# Altium project Atmega 2560.PrjPcb
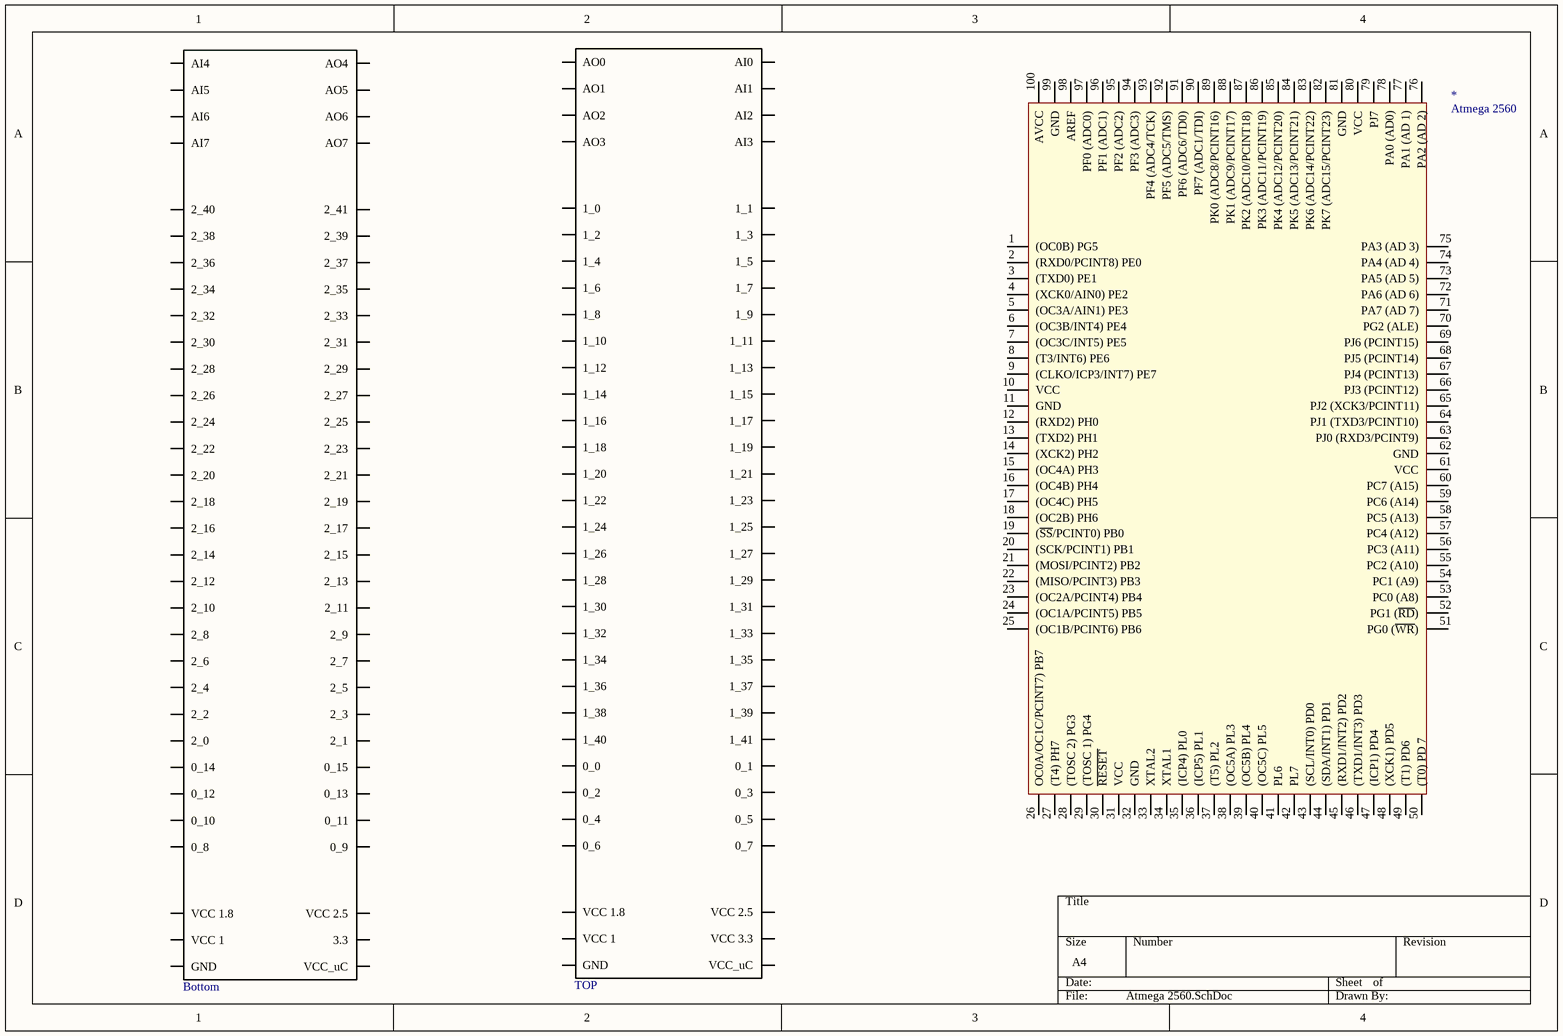
[diagram p0: Atmega 2560.SchDoc]
1 sheet, 3 parts. Net scope: global (net labels, ports and power ports of the same name join across sheets).
Board file: Atmega2560.PcbDoc

## Sheet Atmega 2560.SchDoc
size A4

### Parts
*  Atmega 2560
Bottom  CONNECTOR_BOTTOM  [Connector]  (value not drawn)
TOP  CONNECTOR_TOP  [Connector]  (value not drawn)

### Nets

Not connected (* = marked no-connect by the designer): * 1((OC0B)_PG5) 2((RXD0/PCINT8)_PE0) 3((TXD0)_PE1) 4((XCK0/AIN0)_PE2) 5((OC3A/AIN1)_PE3) 6((OC3B/INT4)_PE4) 7((OC3C/INT5)_PE5) 8((T3/INT6)_PE6) 9((CLKO/ICP3/INT7)_PE7) 10(VCC) 11(GND) 12((RXD2)_PH0) 13((TXD2)_PH1) 14((XCK2)_PH2) 15((OC4A)_PH3) 16((OC4B)_PH4) 17((OC4C)_PH5) 18((OC2B)_PH6) 19((~{SS}/PCINT0)_PB0) 20((SCK/PCINT1)_PB1) 21((MOSI/PCINT2)_PB2) 22((MISO/PCINT3)_PB3) 23((OC2A/PCINT4)_PB4) 24((OC1A/PCINT5)_PB5) 25((OC1B/PCINT6)_PB6) 26(OC0A/OC1C/PCINT7)_PB7) 27((T4)_PH7) 28((TOSC_2)_PG3) 29((TOSC_1)_PG4) 30(~{RESET}) 31(VCC) 32(GND) 33(XTAL2) 34(XTAL1) 35((ICP4)_PL0) 36((ICP5)_PL1) 37((T5)_PL2) 38((OC5A)_PL3) 39((OC5B)_PL4) 40((OC5C)_PL5) 41(PL6) 42(PL7) 43((SCL/INT0)_PD0) 44((SDA/INT1)_PD1) 45((RXD1/INT2)_PD2) 46((TXD1/INT3)_PD3) 47((ICP1)_PD4) 48((XCK1)_PD5) 49((T1)_PD6) 50((T0)_PD_7) 51(PG0_(~{WR})) 52(PG1_(~{RD})) 53(PC0_(A8)) 54(PC1_(A9)) 55(PC2_(A10)) 56(PC3_(A11)) 57(PC4_(A12)) 58(PC5_(A13)) 59(PC6_(A14)) 60(PC7_(A15)) 61(VCC) 62(GND) 63(PJ0_(RXD3/PCINT9)) 64(PJ1_(TXD3/PCINT10)) 65(PJ2_(XCK3/PCINT11)) 66(PJ3_(PCINT12)) 67(PJ4_(PCINT13)) 68(PJ5_(PCINT14)) 69(PJ6_(PCINT15)) 70(PG2_(ALE)) 71(PA7_(AD_7)) 72(PA6_(AD_6)) 73(PA5_(AD_5)) 74(PA4_(AD_4)) 75(PA3_(AD_3)) 76(PA2_(AD_2)) 77(PA1_(AD_1)) 78(PA0_(AD0)) 79(PJ7) 80(VCC) 81(GND) 82(PK7_(ADC15/PCINT23)) 83(PK6_(ADC14/PCINT22)) 84(PK5_(ADC13/PCINT21)) 85(PK4_(ADC12/PCINT20)) 86(PK3_(ADC11/PCINT19)) 87(PK2_(ADC10/PCINT18)) 88(PK1_(ADC9/PCINT17)) 89(PK0_(ADC8/PCINT16)) 90(PF7_(ADC1/TDI)) 91(PF6_(ADC6/TD0)) 92(PF5_(ADC5/TMS)) 93(PF4_(ADC4/TCK)) 94(PF3_(ADC3)) 95(PF2_(ADC2)) 96(PF1_(ADC1)) 97(PF0_(ADC0)) 98(AREF) 99(GND) 100(AVCC); Bottom 0(GND) 1(VCC_1) 2(VCC_1.8) 3(0_8) 4(0_10) 5(0_12) 6(0_14) 7(2_0) 8(2_2) 9(2_4) 10(2_6) 11(2_8) 12(2_10) 13(2_12) 14(2_14) 15(2_16) 16(2_18) 17(2_20) 18(2_22) 19(2_24) 20(2_26) 21(2_28) 22(2_30) 23(2_32) 24(2_34) 25(2_36) 26(2_38) 27(2_40) 28(AI7) 29(AI6) 30(AI5) 31(AI4) 32(AO4) 33(AO5) 34(AO6) 35(AO7) 36(2_41) 37(2_39) 38(2_37) 39(2_35) 40(2_33) 41(2_31) 42(2_29) 43(2_27) 44(2_25) 45(2_23) 46(2_21) 47(2_19) 48(2_17) 49(2_15) 50(2_13) 51(2_11) 52(2_9) 53(2_7) 54(2_5) 55(2_3) 56(2_1) 57(0_15) 58(0_13) 59(0_11) 60(0_9) 61(VCC_2.5) 62(3.3) 63(VCC_uC); TOP 0(GND) 1(VCC_1) 2(VCC_1.8) 3(0_6) 4(0_4) 5(0_2) 6(0_0) 7(1_40) 8(1_38) 9(1_36) 10(1_34) 11(1_32) 12(1_30) 13(1_28) 14(1_26) 15(1_24) 16(1_22) 17(1_20) 18(1_18) 19(1_16) 20(1_14) 21(1_12) 22(1_10) 23(1_8) 24(1_6) 25(1_4) 26(1_2) 27(1_0) 28(AO3) 29(AO2) 30(AO1) 31(AO0) 32(AI0) 33(AI1) 34(AI2) 35(AI3) 36(1_1) 37(1_3) 38(1_5) 39(1_7) 40(1_9) 41(1_11) 42(1_13) 43(1_15) 44(1_17) 45(1_19) 46(1_21) 47(1_23) 48(1_25) 49(1_27) 50(1_29) 51(1_31) 52(1_33) 53(1_35) 54(1_37) 55(1_39) 56(1_41) 57(0_1) 58(0_3) 59(0_5) 60(0_7) 61(VCC_2.5) 62(VCC_3.3) 63(VCC_uC)

### Library data of the parts
Bottom = CONNECTOR_BOTTOM: control board connector
TOP = CONNECTOR_TOP: control board connector; Value: 10 k